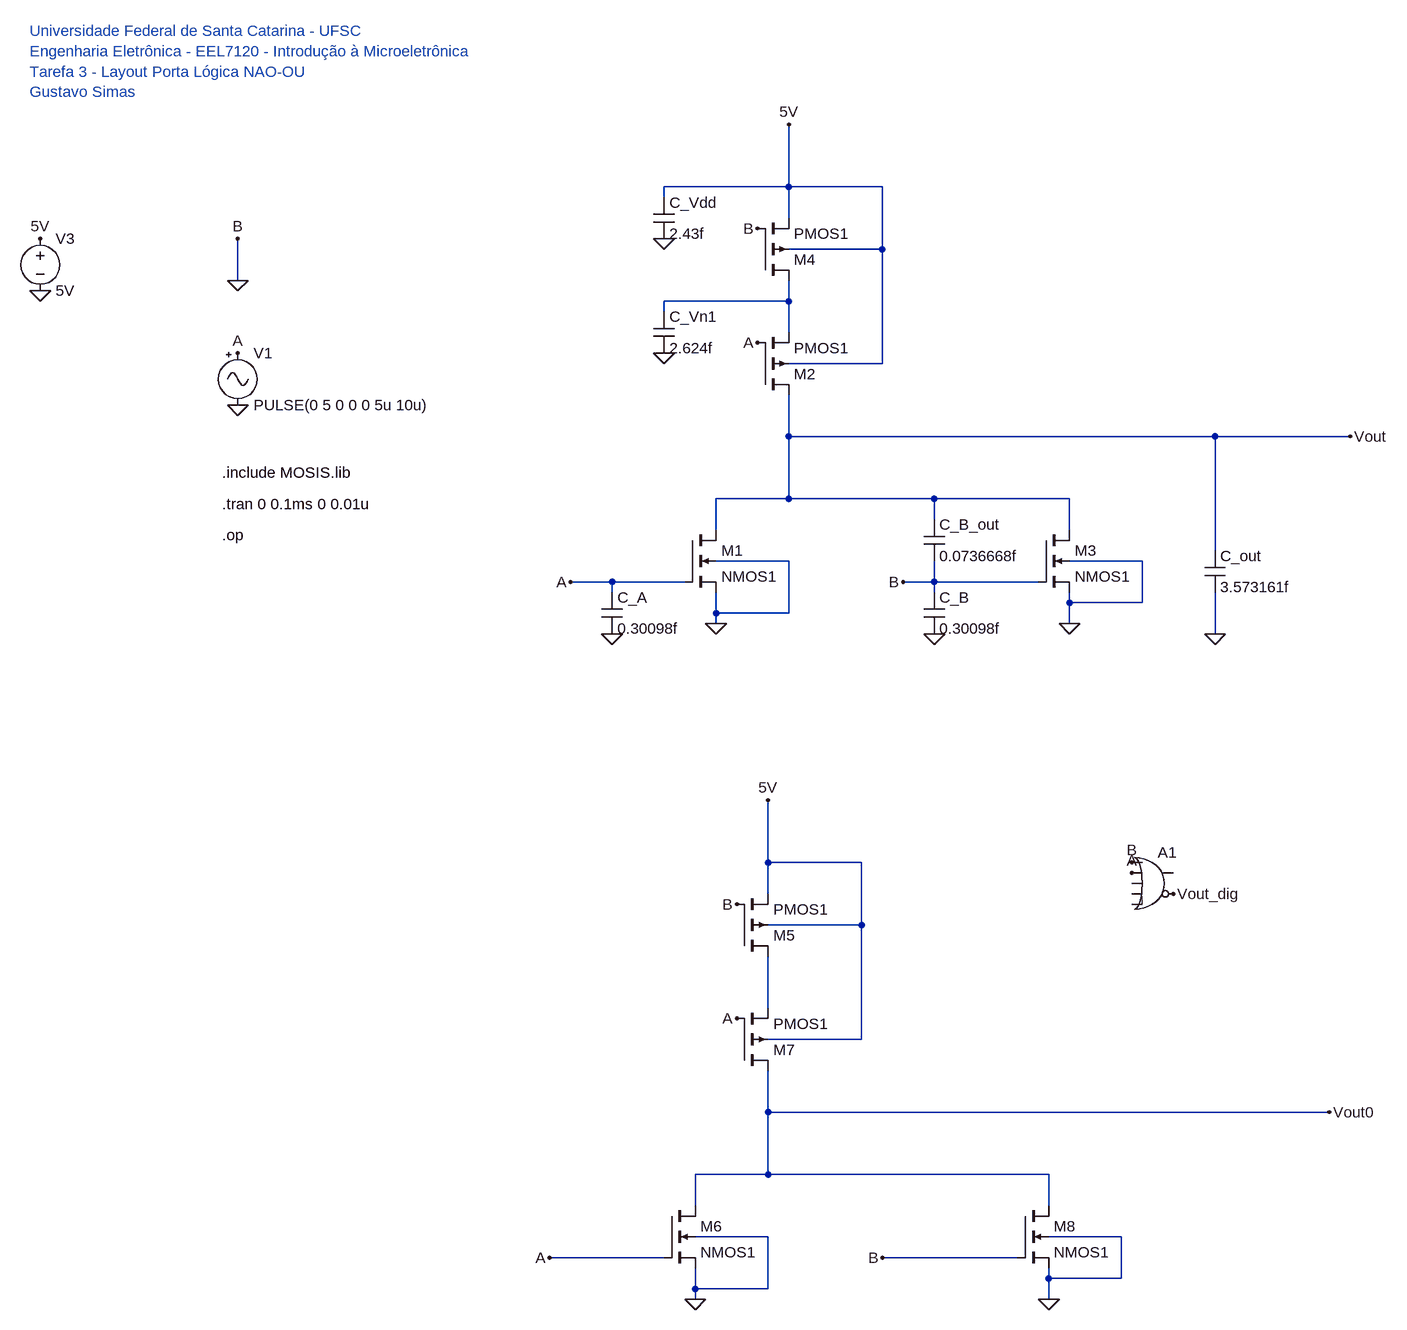
[diagram p0: schematic 2nor1_spice.asc]
2nor1_spice.asc, the LTspice schematic file:
Version 4
SHEET 1 1368 1684
WIRE 432 -64 432 -160
WIRE 432 -64 240 -64
WIRE 576 -64 432 -64
WIRE 240 -48 240 -64
WIRE 432 -16 432 -64
WIRE 576 32 576 -64
WIRE 576 32 432 32
WIRE -416 80 -416 16
WIRE 432 112 432 80
WIRE 432 112 240 112
WIRE 240 128 240 112
WIRE 432 160 432 112
WIRE 576 208 576 32
WIRE 576 208 432 208
WIRE 432 320 432 256
WIRE 1088 320 432 320
WIRE 1296 320 1088 320
WIRE 432 416 432 320
WIRE 432 416 320 416
WIRE 656 416 432 416
WIRE 864 416 656 416
WIRE 656 448 656 416
WIRE 320 464 320 416
WIRE 864 464 864 416
WIRE 1088 496 1088 320
WIRE 432 512 320 512
WIRE 976 512 864 512
WIRE 160 544 96 544
WIRE 272 544 160 544
WIRE 656 544 656 512
WIRE 656 544 608 544
WIRE 816 544 656 544
WIRE 160 560 160 544
WIRE 656 560 656 544
WIRE 864 576 864 560
WIRE 976 576 976 512
WIRE 976 576 864 576
WIRE 320 592 320 560
WIRE 432 592 432 512
WIRE 432 592 320 592
WIRE 320 608 320 592
WIRE 864 608 864 576
WIRE 1088 624 1088 560
WIRE 400 976 400 880
WIRE 544 976 400 976
WIRE 400 1024 400 976
WIRE 544 1072 544 976
WIRE 544 1072 400 1072
WIRE 400 1200 400 1120
WIRE 544 1248 544 1072
WIRE 544 1248 400 1248
WIRE 400 1360 400 1296
WIRE 1264 1360 400 1360
WIRE 400 1456 400 1360
WIRE 400 1456 288 1456
WIRE 832 1456 400 1456
WIRE 288 1504 288 1456
WIRE 832 1504 832 1456
WIRE 400 1552 288 1552
WIRE 944 1552 832 1552
WIRE 240 1584 64 1584
WIRE 784 1584 576 1584
WIRE 832 1616 832 1600
WIRE 944 1616 944 1552
WIRE 944 1616 832 1616
WIRE 288 1632 288 1600
WIRE 400 1632 400 1552
WIRE 400 1632 288 1632
WIRE 288 1648 288 1632
WIRE 832 1648 832 1616
FLAG 432 -160 5V
FLAG 320 608 0
FLAG 864 608 0
FLAG 384 176 A
FLAG 96 544 A
FLAG 384 0 B
FLAG 608 544 B
FLAG -416 272 0
FLAG -416 192 A
FLAG -416 16 B
FLAG -416 80 0
FLAG 240 16 0
FLAG 240 192 0
FLAG 160 624 0
FLAG 656 624 0
FLAG 1088 624 0
FLAG 1296 320 Vout
FLAG 400 880 5V
FLAG 288 1648 0
FLAG 832 1648 0
FLAG 352 1216 A
FLAG 64 1584 A
FLAG 352 1040 B
FLAG 576 1584 B
FLAG 1264 1360 Vout0
FLAG 960 976 B
FLAG 960 992 A
FLAG 1024 1024 Vout_dig
FLAG -720 96 0
FLAG -720 16 5V
SYMBOL pmos4 384 80 M180
SYMATTR InstName M4
SYMATTR Value PMOS1
SYMATTR Value2 l=2u w=14u
SYMBOL nmos4 272 464 R0
SYMATTR InstName M1
SYMATTR Value NMOS1
SYMATTR Value2 l=2u w=6u
SYMBOL pmos4 384 256 M180
SYMATTR InstName M2
SYMATTR Value PMOS1
SYMATTR Value2 l=2u w=14u
SYMBOL nmos4 816 464 R0
SYMATTR InstName M3
SYMATTR Value NMOS1
SYMATTR Value2 l=2u w=6u
SYMBOL Misc\\signal -416 176 R0
WINDOW 123 0 0 Left 0
WINDOW 39 0 0 Left 0
SYMATTR InstName V1
SYMATTR Value PULSE(0 5 0 0 0 5u 10u)
SYMBOL cap 224 -48 R0
SYMATTR InstName C_Vdd
SYMATTR Value 2.43f
SYMBOL cap 224 128 R0
SYMATTR InstName C_Vn1
SYMATTR Value 2.624f
SYMBOL cap 144 560 R0
SYMATTR InstName C_A
SYMATTR Value 0.30098f
SYMBOL cap 640 560 R0
SYMATTR InstName C_B
SYMATTR Value 0.30098f
SYMBOL cap 640 448 R0
SYMATTR InstName C_B_out
SYMATTR Value 0.0736668f
SYMBOL cap 1072 496 R0
SYMATTR InstName C_out
SYMATTR Value 3.573161f
SYMBOL pmos4 352 1120 M180
SYMATTR InstName M5
SYMATTR Value PMOS1
SYMATTR Value2 l=2u w=14u
SYMBOL nmos4 240 1504 R0
SYMATTR InstName M6
SYMATTR Value NMOS1
SYMATTR Value2 l=2u w=6u
SYMBOL pmos4 352 1296 M180
SYMATTR InstName M7
SYMATTR Value PMOS1
SYMATTR Value2 l=2u w=14u
SYMBOL nmos4 784 1504 R0
SYMATTR InstName M8
SYMATTR Value NMOS1
SYMATTR Value2 l=2u w=6u
SYMBOL Digital\\or 992 944 R0
SYMATTR InstName A1
SYMATTR Value2 5
SYMBOL voltage -720 0 R0
WINDOW 123 0 0 Left 0
WINDOW 39 0 0 Left 0
SYMATTR InstName V3
SYMATTR Value 5V
TEXT -440 376 Left 2 !.include MOSIS.lib
TEXT -736 -304 Left 2 ;Universidade Federal de Santa Catarina - UFSC\nEngenharia Eletrônica - EEL7120 - Introdução à Microeletrônica\nTarefa 3 - Layout Porta Lógica NAO-OU\nGustavo Simas
TEXT -440 424 Left 2 !.tran 0 0.1ms 0 0.01u
TEXT -440 472 Left 2 !.op

The netlist it stands for:
* 2nor1_spice.asc
M4 N001 0 5V 5V PMOS1 l=2u w=14u
M1 Vout A 0 0 NMOS1 l=2u w=6u
M2 Vout A N001 5V PMOS1 l=2u w=14u
M3 Vout 0 0 0 NMOS1 l=2u w=6u
V1 A 0 PULSE(0 5 0 0 0 5u 10u)
C_Vdd 5V 0 2.43f
C_Vn1 N001 0 2.624f
C_A A 0 0.30098f
C_B 0 0 0.30098f
C_B_out Vout 0 0.0736668f
C_out Vout 0 3.573161f
M5 N002 0 5V 5V PMOS1 l=2u w=14u
M6 Vout0 A 0 0 NMOS1 l=2u w=6u
M7 Vout0 A N002 5V PMOS1 l=2u w=14u
M8 Vout0 0 0 0 NMOS1 l=2u w=6u
A1 0 A 0 0 0 Vout_dig 0 0 OR 5
V3 5V 0 5V
.model NMOS NMOS
.model PMOS PMOS
.lib standard.mos
.include MOSIS.lib
* Universidade Federal de Santa Catarina - UFSC
* Engenharia Eletrônica - EEL7120 - Introdução à Microeletrônica
* Tarefa 3 - Layout Porta Lógica NAO-OU
* Gustavo Simas
.tran 0 0.1ms 0 0.01u
.op
.backanno
.end